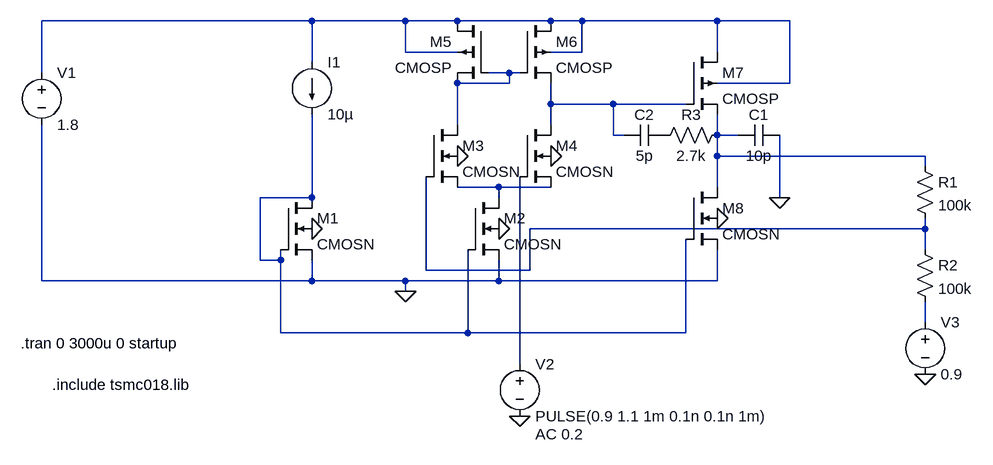
[diagram p0: schematic opamp2.asc]
opamp2.asc, the LTspice schematic file:
Version 4.1
SHEET 1 1064 680
WIRE -96 -112 -512 -112
WIRE 48 -112 -96 -112
WIRE 128 -112 48 -112
WIRE 272 -112 128 -112
WIRE 320 -112 272 -112
WIRE 528 -112 320 -112
WIRE 640 -112 528 -112
WIRE 48 -64 48 -112
WIRE 128 -64 48 -64
WIRE 320 -64 320 -112
WIRE 320 -64 272 -64
WIRE 528 -64 528 -112
WIRE -96 -48 -96 -112
WIRE -512 -32 -512 -112
WIRE 208 -32 176 -32
WIRE 224 -32 208 -32
WIRE 208 -16 208 -32
WIRE 208 -16 128 -16
WIRE 640 -16 640 -112
WIRE 640 -16 528 -16
WIRE 272 16 272 -16
WIRE 368 16 272 16
WIRE 480 16 368 16
WIRE 128 48 128 -16
WIRE 272 48 272 16
WIRE 368 64 368 16
WIRE 384 64 368 64
WIRE 528 64 528 32
WIRE 560 64 528 64
WIRE 528 96 528 64
WIRE 848 96 528 96
WIRE 848 112 848 96
WIRE 192 144 128 144
WIRE 272 144 192 144
WIRE 528 144 528 96
WIRE -96 160 -96 32
WIRE -96 160 -176 160
WIRE 192 160 192 144
WIRE 624 160 624 64
WIRE -96 176 -96 160
WIRE 848 208 848 192
WIRE 848 208 240 208
WIRE 848 240 848 208
WIRE -176 256 -176 160
WIRE -144 256 -144 240
WIRE -144 256 -176 256
WIRE 80 272 80 128
WIRE 240 272 240 208
WIRE 240 272 80 272
WIRE -512 288 -512 48
WIRE -96 288 -96 256
WIRE -96 288 -512 288
WIRE 48 288 -96 288
WIRE 192 288 192 256
WIRE 192 288 48 288
WIRE 528 288 528 240
WIRE 528 288 192 288
WIRE 48 304 48 288
WIRE 848 352 848 320
WIRE -144 368 -144 256
WIRE 144 368 144 240
WIRE 144 368 -144 368
WIRE 480 368 480 224
WIRE 480 368 144 368
WIRE 224 416 224 128
FLAG -96 208 0
FLAG 192 208 0
FLAG 48 304 0
FLAG 272 96 0
FLAG 128 96 0
FLAG 528 192 0
FLAG 624 160 0
FLAG 848 432 0
FLAG 224 496 0
SYMBOL cmosn -144 160 R0
SYMATTR InstName M1
SYMATTR Value2 l=1u w=2.5u
SYMBOL cmosn 144 160 R0
SYMATTR InstName M2
SYMATTR Value2 l=1u w=25u
SYMBOL voltage -512 -48 R0
WINDOW 123 0 0 Left 0
WINDOW 39 0 0 Left 0
SYMATTR InstName V1
SYMATTR Value 1.8
SYMBOL cmosn 80 48 R0
SYMATTR InstName M3
SYMATTR Value2 l=1u w=15u
SYMBOL cmosn 224 48 R0
SYMATTR InstName M4
SYMATTR Value2 l=1u w=15u
SYMBOL cmosp 176 -112 M0
SYMATTR InstName M5
SYMATTR Value2 l=1u w=25u
SYMBOL cmosp 224 -112 R0
SYMATTR InstName M6
SYMATTR Value2 l=1u w=25u
SYMBOL cmosp 480 -64 R0
SYMATTR InstName M7
SYMATTR Value2 l=1u w=50u
SYMBOL cmosn 480 144 R0
SYMATTR InstName M8
SYMATTR Value2 l=1u w=25u
SYMBOL current -96 -48 R0
WINDOW 123 0 0 Left 0
WINDOW 39 0 0 Left 0
SYMATTR InstName I1
SYMATTR Value 10µ
SYMBOL cap 560 80 R270
WINDOW 0 32 32 VTop 2
WINDOW 3 0 32 VBottom 2
SYMATTR InstName C1
SYMATTR Value 10p
SYMBOL cap 448 48 R90
WINDOW 0 0 32 VBottom 2
WINDOW 3 32 32 VTop 2
SYMATTR InstName C2
SYMATTR Value 5p
SYMBOL res 832 96 R0
SYMATTR InstName R1
SYMATTR Value 100k
SYMBOL res 832 224 R0
SYMATTR InstName R2
SYMATTR Value 100k
SYMBOL voltage 224 400 R0
WINDOW 123 24 124 Left 2
WINDOW 39 0 0 Left 0
SYMATTR Value2 AC 0.2
SYMATTR InstName V2
SYMATTR Value PULSE(0.9 1.1 1m 0.1n 0.1n 1m)
SYMBOL voltage 848 336 R0
WINDOW 123 0 0 Left 0
WINDOW 39 0 0 Left 0
SYMATTR InstName V3
SYMATTR Value 0.9
SYMBOL res 544 48 R90
WINDOW 0 0 56 VBottom 2
WINDOW 3 32 56 VTop 2
SYMATTR InstName R3
SYMATTR Value 2.7k
TEXT -544 384 Left 2 !.tran 0 3000u 0 startup
TEXT -496 448 Left 2 !.include tsmc018.lib

The netlist it stands for:
* opamp2.asc
M1 N006 N006 0 0 CMOSN l=1u w=2.5u
M2 N005 N006 0 0 CMOSN l=1u w=25u
V1 N001 0 1.8
M3 N002 N007 N005 0 CMOSN l=1u w=15u
M4 N003 N009 N005 0 CMOSN l=1u w=15u
M5 N001 N002 N002 N001 CMOSP l=1u w=25u
M6 N001 N002 N003 N001 CMOSP l=1u w=25u
M7 N001 N003 N004 N001 CMOSP l=1u w=50u
M8 N004 N006 0 0 CMOSN l=1u w=25u
I1 N001 N006 10µ
C1 N004 0 10p
C2 P001 N003 5p
R1 N004 N007 100k
R2 N007 N008 100k
V2 N009 0 PULSE(0.9 1.1 1m 0.1n 0.1n 1m) AC 0.2
V3 N008 0 0.9
R3 N004 P001 2.7k
.model NMOS NMOS
.model PMOS PMOS
.lib standard.mos
.tran 0 3000u 0 startup
.include tsmc018.lib
.backanno
.end